# EAGLE design I2C_WAV_HalfShield (EAGLE 6.5.0)
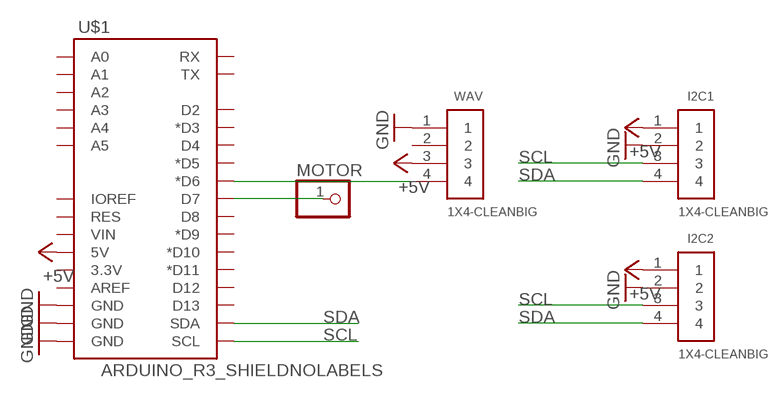
[diagram p0: schematic, sheet 1]

## Parts
I2C1  1X4-CLEANBIG  [1X04-CLEANBIG]
I2C2  1X4-CLEANBIG  [1X04-CLEANBIG]
MOTOR  PINHD-1X1CB  [1X01-CLEANBIG]
U$1  ARDUINO_R3_SHIELDNOLABELS  [UNO_R3_SHIELD_NOLABELS]
WAV  1X4-CLEANBIG  [1X04-CLEANBIG]

## Nets
+5V: I2C1.1 I2C2.1 U$1.5V WAV.3
GND: I2C1.2 I2C2.2 U$1.GND@0(GND) U$1.GND@1(GND) U$1.GND@2(GND) WAV.1
N$1: MOTOR.1 U$1.D7
N$2: U$1.D6(*D6) WAV.4
SCL: I2C1.3 I2C2.3 U$1.SCL
SDA: I2C1.4 I2C2.4 U$1.SDA
Unconnected: U$1.3.3V U$1.A0 U$1.A1 U$1.A2 U$1.A3 U$1.A4 U$1.A5 U$1.AREF U$1.D2 U$1.D3(*D3) U$1.D4 U$1.D5(*D5) U$1.D8 U$1.D9(*D9) U$1.D10(*D10) U$1.D11(*D11) U$1.D12 U$1.D13 U$1.IOREF U$1.RES U$1.RX U$1.TX U$1.VIN WAV.2

## Library data of the parts
I2C1 I2C2 WAV = adafruit:1X4: 4-pin connector
MOTOR = adafruit:PINHD-1X1: Pin header 1x1 for 0.1" spacing With round pins
U$1 = FJT-HALF_SHIELD:ARDUINO_R3_SHIELD: Shield form compatible with the Arduino Uno R3.

## Board
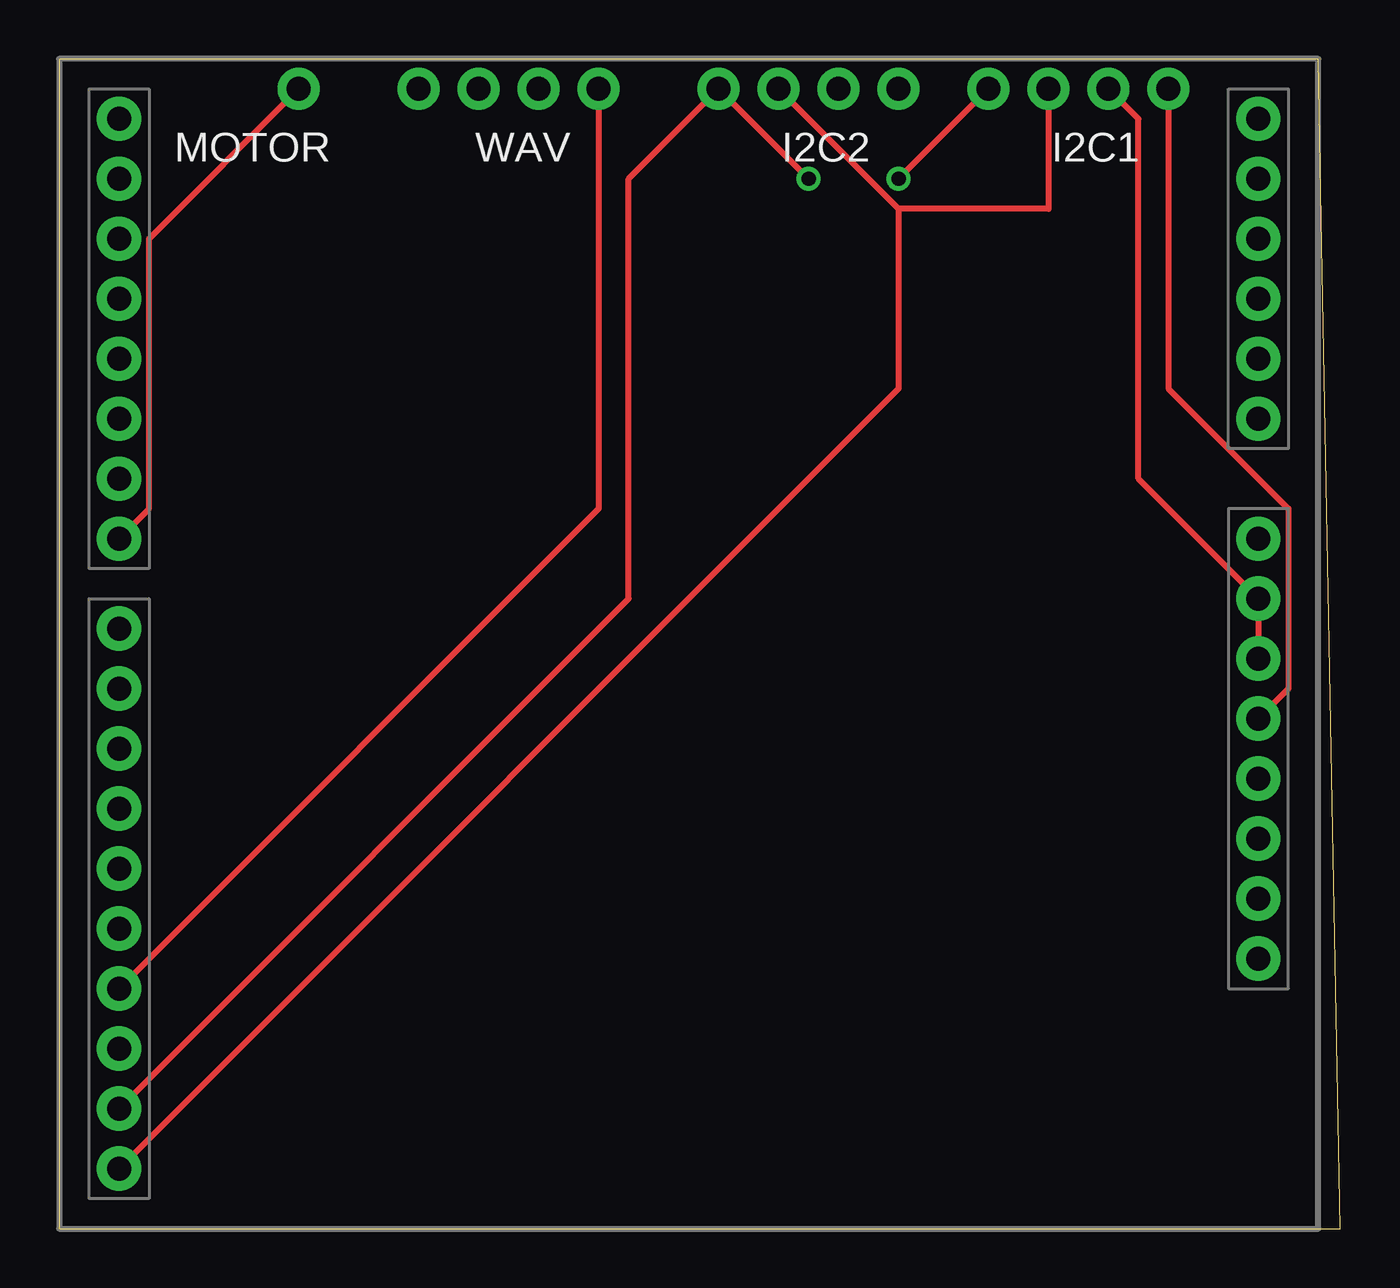
[diagram p1: board, top side]
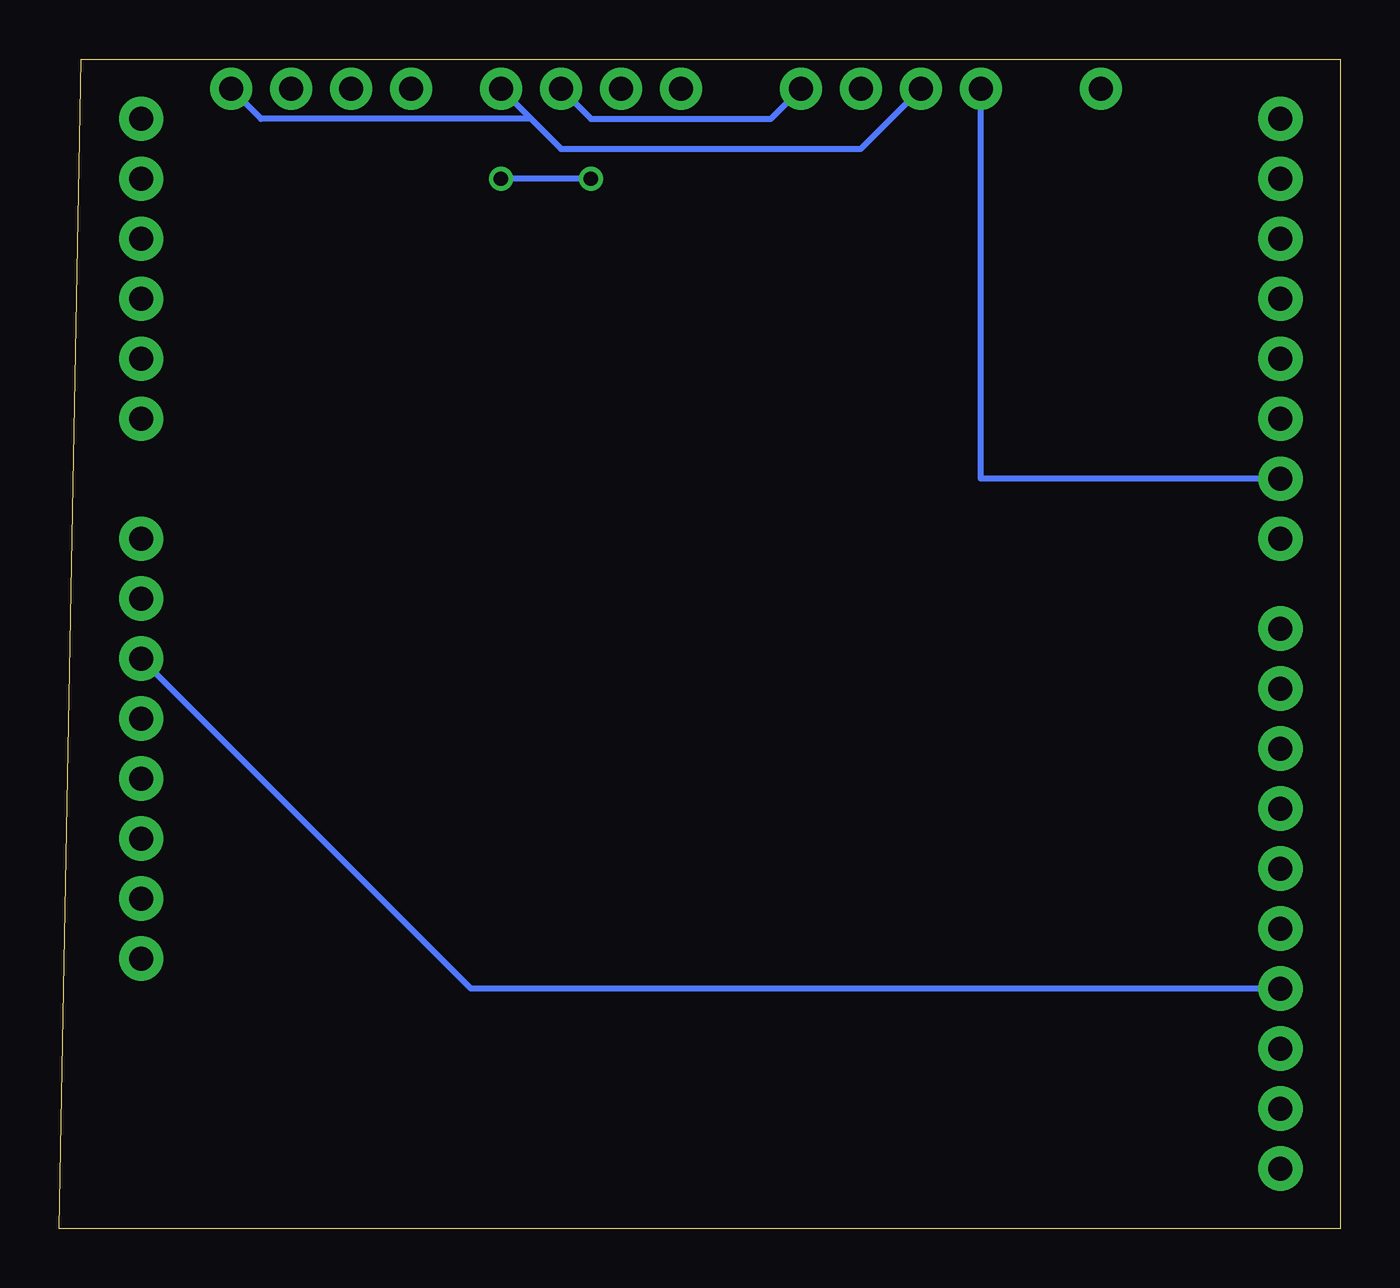
[diagram p2: board, bottom side, seen from below]

Size 54.28 x 49.52 mm. Coordinates in mm from the lower left corner, seen from the top.
Outline: 0,0 54.28,0 53.34,49.52 0,49.52 0,0
Copper layers (1*16): Top 0.035mm / dielectric 1.5mm / Bottom 0.035mm
Design rules "default": minimum track width 10mil, minimum drill 24mil, track to track 8mil, track to pad 8mil, pad to pad 8mil, via to via 8mil, smd to smd 8mil, copper to edge 40mil, drill to drill 8mil, minimum pad ring 10mil, minimum via ring 8mil, stop-mask expansion 4mil, vias tented up to drill 0mil, thermal gap 10mil

### Footprints (pad centres in the part's own frame; a part is rotated, then mirrored left to right if it is on the bottom)
1X04-CLEANBIG = drill 1.016 pad 1.778: 1 -3.81,0; 2 -1.27,0; 3 1.27,0; 4 3.81,0
1X01-CLEANBIG = drill 1.016 pad 1.778: 1 0,0
UNO_R3_SHIELD_NOLABELS = drill 1.016 pad 1.88: 3.3V 50.8,26.67; 5V 50.8,29.21; A0 50.8,41.91; A1 50.8,44.45; A2 50.8,46.99; A3 50.8,49.53; A4 50.8,52.07; A5 50.8,54.61; AREF 2.54,15.24; D2 2.54,49.53; D3 2.54,46.99; D4 2.54,44.45; D5 2.54,41.91; D6 2.54,39.37; D7 2.54,36.83; D8 2.54,33.02; D9 2.54,30.48; D10 2.54,27.94; D11 2.54,25.4; D12 2.54,22.86; D13 2.54,20.32; GND@0 50.8,31.75; GND@1 50.8,34.29; GND@2 2.54,17.78; IOREF 50.8,21.59; NC 50.8,19.05; RES 50.8,24.13; RX 2.54,54.61; SCL 2.54,10.16; SDA 2.54,12.7; TX 2.54,52.07; VIN 50.8,36.83

### Placement (x,y rotation side)
I2C1  43.18,48.26 180 top
I2C2  31.75,48.26 180 top
MOTOR  10.16,48.26 180 top
U$1  0,-7.62 0 top
WAV  19.05,48.26 180 top

### Tracks (layer width: path | path; a pad name or v marks a point on that pad's centre or on a via)
+5V
  Top 0.254: U$1.5V 52.07,22.86 52.07,30.48 46.99,35.56 I2C1.1
  Bottom 0.254: WAV.3 20.32,45.72 33.02,45.72 34.29,46.99 | I2C2.1 34.29,46.99 | I2C1.1 45.72,46.99 34.29,46.99
GND
  Top 0.254: I2C1.2 45.72,46.99 45.72,31.75 U$1.GND@1 U$1.GND@0 | U$1.GND@2 22.86,30.48 WAV.1
  Bottom 0.254: WAV.1 24.13,46.99 31.75,46.99 I2C2.2 | U$1.GND@0 36.83,10.16 U$1.GND@2
N$1
  Top 0.254: MOTOR.1 3.81,41.91 3.81,30.48 U$1.D7
N$2
  Bottom 0.254: WAV.4 15.24,31.75 U$1.D6
SCL
  Top 0.254: 35.56,43.18 I2C2.3 | 35.56,43.18 41.91,43.18 I2C1.3 | U$1.SCL 35.56,35.56 35.56,43.18
SDA  (via drill 0.61)
  Top 0.254: U$1.SDA 24.13,26.67 24.13,44.45 I2C2.4 v31.75,44.45 | v35.56,44.45 I2C1.4
  Bottom 0.254: v31.75,44.45 v35.56,44.45